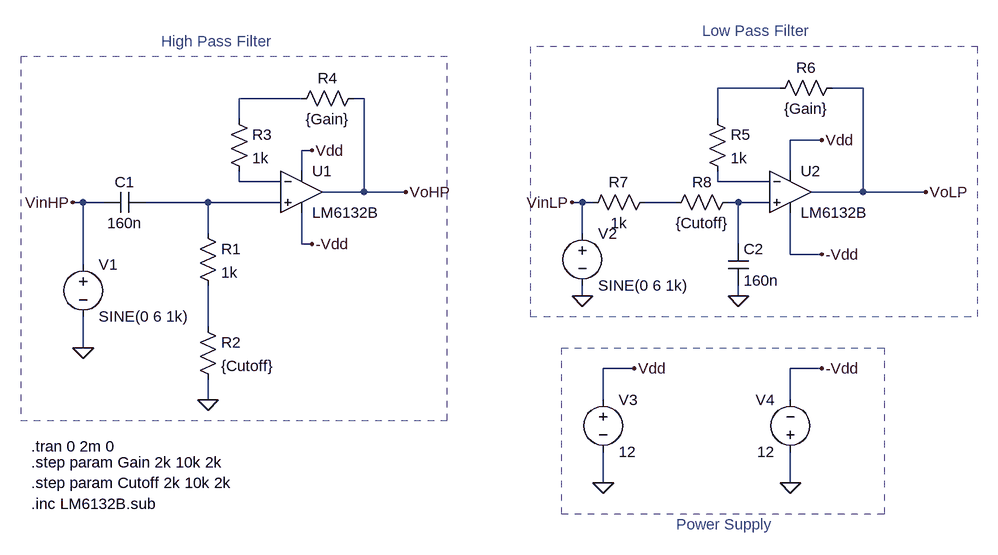
[diagram p0: schematic Filters.asc]
Filters.asc, the LTspice schematic file:
Version 4
SHEET 1 1076 680
WIRE 768 -16 672 -16
WIRE 896 -16 848 -16
WIRE 32 0 -64 0
WIRE 128 0 112 0
WIRE -64 32 -64 0
WIRE 672 32 672 -16
WIRE 832 64 784 64
WIRE 48 80 32 80
WIRE 32 112 32 80
WIRE 784 112 784 64
WIRE -64 128 -64 112
WIRE 0 128 -64 128
WIRE 672 128 672 112
WIRE 752 128 672 128
WIRE 128 144 128 0
WIRE 128 144 64 144
WIRE 192 144 128 144
WIRE 896 144 896 -16
WIRE 896 144 816 144
WIRE 992 144 896 144
WIRE -304 160 -320 160
WIRE -272 160 -304 160
WIRE -112 160 -208 160
WIRE 0 160 -112 160
WIRE 464 160 448 160
WIRE 480 160 464 160
WIRE 608 160 560 160
WIRE 704 160 688 160
WIRE 752 160 704 160
WIRE -112 208 -112 160
WIRE 464 208 464 160
WIRE 32 224 32 176
WIRE 48 224 32 224
WIRE 704 224 704 160
WIRE 784 240 784 176
WIRE 832 240 784 240
WIRE -304 256 -304 160
WIRE 464 304 464 288
WIRE 704 304 704 288
WIRE -112 352 -112 288
WIRE -304 384 -304 336
WIRE 544 416 496 416
WIRE 832 416 784 416
WIRE -112 464 -112 432
WIRE 496 464 496 416
WIRE 784 464 784 416
WIRE 496 592 496 544
WIRE 784 592 784 544
FLAG -112 464 0
FLAG 48 80 Vdd
FLAG 832 64 Vdd
FLAG 48 224 -Vdd
FLAG 832 240 -Vdd
FLAG 192 144 VoHP
FLAG 992 144 VoLP
FLAG -320 160 VinHP
FLAG 448 160 VinLP
FLAG 704 304 0
FLAG 464 304 0
FLAG -304 384 0
FLAG 784 592 0
FLAG 496 592 0
FLAG 544 416 Vdd
FLAG 832 416 -Vdd
SYMBOL OpAmps\\opamp2 32 80 R0
SYMATTR InstName U1
SYMATTR Value LM6132B
SYMBOL OpAmps\\opamp2 784 80 R0
SYMATTR InstName U2
SYMATTR Value LM6132B
SYMBOL cap -208 144 R90
WINDOW 0 0 32 VBottom 2
WINDOW 3 32 32 VTop 2
SYMATTR InstName C1
SYMATTR Value 160n
SYMBOL res -128 192 R0
SYMATTR InstName R1
SYMATTR Value 1k
SYMBOL res -128 336 R0
SYMATTR InstName R2
SYMATTR Value {Cutoff}
SYMBOL res -80 16 R0
SYMATTR InstName R3
SYMATTR Value 1k
SYMBOL res 128 -16 R90
WINDOW 0 0 56 VBottom 2
WINDOW 3 32 56 VTop 2
SYMATTR InstName R4
SYMATTR Value {Gain}
SYMBOL res 656 16 R0
SYMATTR InstName R5
SYMATTR Value 1k
SYMBOL res 864 -32 R90
WINDOW 0 0 56 VBottom 2
WINDOW 3 32 56 VTop 2
SYMATTR InstName R6
SYMATTR Value {Gain}
SYMBOL res 576 144 R90
WINDOW 0 0 56 VBottom 2
WINDOW 3 32 56 VTop 2
SYMATTR InstName R7
SYMATTR Value 1k
SYMBOL res 704 144 R90
WINDOW 0 0 56 VBottom 2
WINDOW 3 32 56 VTop 2
SYMATTR InstName R8
SYMATTR Value {Cutoff}
SYMBOL cap 688 224 R0
SYMATTR InstName C2
SYMATTR Value 160n
SYMBOL voltage -304 240 R0
WINDOW 123 0 0 Left 0
WINDOW 39 0 0 Left 0
SYMATTR InstName V1
SYMATTR Value SINE(0 6 1k)
SYMBOL voltage 464 192 R0
WINDOW 123 0 0 Left 0
WINDOW 39 0 0 Left 0
SYMATTR InstName V2
SYMATTR Value SINE(0 6 1k)
SYMBOL voltage 496 448 R0
WINDOW 123 0 0 Left 0
WINDOW 39 0 0 Left 0
SYMATTR InstName V3
SYMATTR Value 12
SYMBOL voltage 784 560 R180
WINDOW 0 24 96 Left 2
WINDOW 3 24 16 Left 2
WINDOW 123 0 0 Left 0
WINDOW 39 0 0 Left 0
SYMATTR InstName V4
SYMATTR Value 12
TEXT -184 -88 Left 2 ;High Pass Filter
TEXT 648 -104 Left 2 ;Low Pass Filter
TEXT -384 560 Left 2 !.step param Gain 2k 10k 2k
TEXT -384 592 Left 2 !.step param Cutoff 2k 10k 2k
TEXT -384 624 Left 2 !.inc LM6132B.sub
TEXT 608 656 Left 2 ;Power Supply
TEXT -384 536 Left 2 !.tran 0 2m 0
RECTANGLE Normal 256 -64 -400 496 2
RECTANGLE Normal 1072 -80 384 336 2
RECTANGLE Normal 928 640 432 384 2

The netlist it stands for:
* Filters.asc
XU1 N005 N003 Vdd -Vdd VoHP LM6132B  ; pins In+ In- V+ V- OUT
XU2 N007 N004 Vdd -Vdd VoLP LM6132B  ; pins In+ In- V+ V- OUT
C1 N005 VinHP 160n
R1 N005 N008 1k
R2 N008 0 {Cutoff}
R3 N002 N003 1k
R4 VoHP N002 {Gain}
R5 N001 N004 1k
R6 VoLP N001 {Gain}
R7 N006 VinLP 1k
R8 N007 N006 {Cutoff}
C2 N007 0 160n
V1 VinHP 0 SINE(0 6 1k)
V2 VinLP 0 SINE(0 6 1k)
V3 Vdd 0 12
V4 0 -Vdd 12
* High Pass Filter
* Low Pass Filter
.step param Gain 2k 10k 2k
.step param Cutoff 2k 10k 2k
.inc LM6132B.sub
* Power Supply
.tran 0 2m 0
.backanno
.end